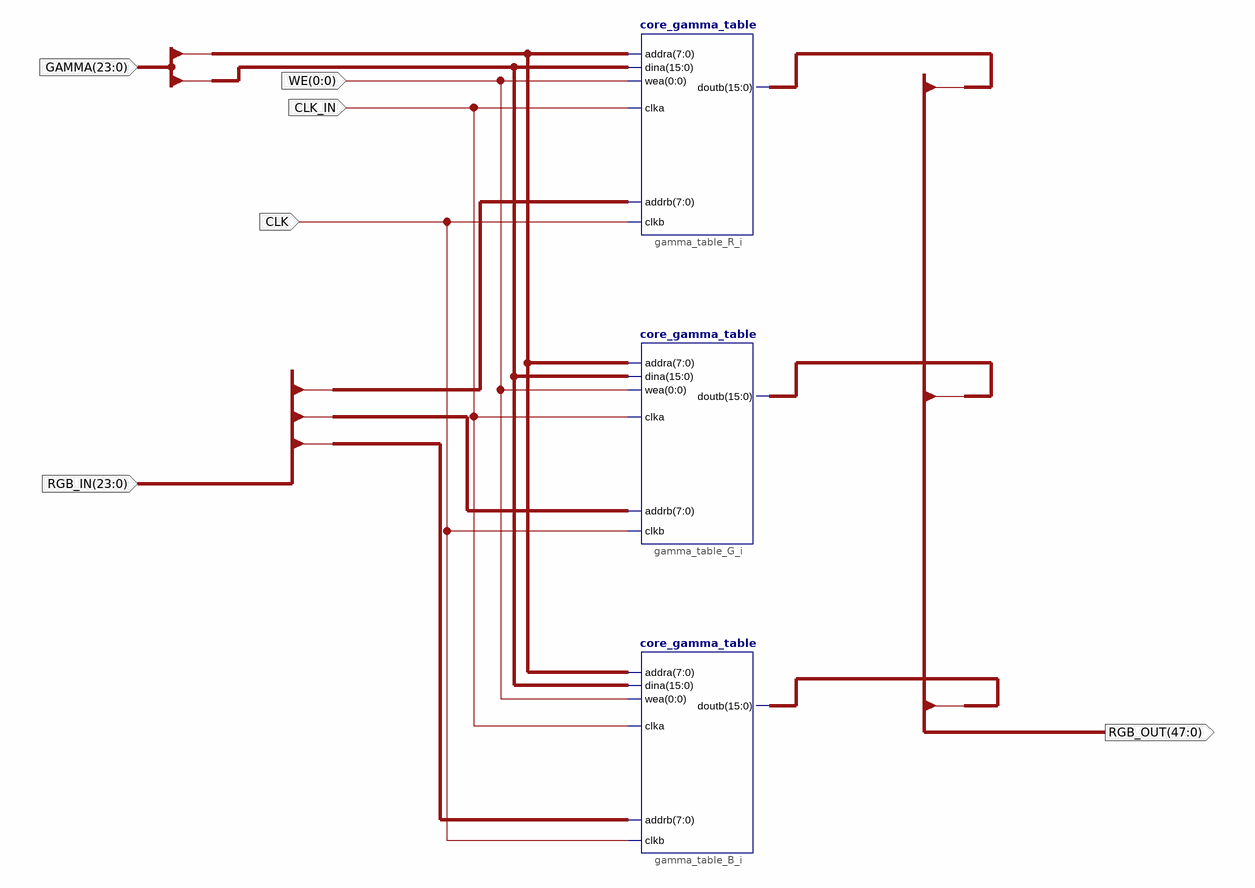
[diagram p0: schematic sheet 1]
// Xilinx ISE schematic RGB_GAMMA_SCH.sch (spartan6) as structural Verilog: 3 symbols, 6 ports
module RGB_GAMMA_SCH (
  input  [0:0] WE,
  input  CLK_IN,
  input  CLK,
  input  [23:0] GAMMA,
  input  [23:0] RGB_IN,
  output [47:0] RGB_OUT
);

  core_gamma_table gamma_table_R_i (
    .addra(GAMMA[23:16]), .dina(GAMMA[15:0]), .addrb(RGB_IN[23:16]), .wea(WE[0]), .clka(CLK_IN), .clkb(CLK),
    .doutb(RGB_OUT[47:32]));
  core_gamma_table gamma_table_G_i (
    .addra(GAMMA[23:16]), .dina(GAMMA[15:0]), .addrb(RGB_IN[15:8]), .wea(WE[0]), .clka(CLK_IN), .clkb(CLK),
    .doutb(RGB_OUT[31:16]));
  core_gamma_table gamma_table_B_i (
    .addra(GAMMA[23:16]), .dina(GAMMA[15:0]), .addrb(RGB_IN[7:0]), .wea(WE[0]), .clka(CLK_IN), .clkb(CLK),
    .doutb(RGB_OUT[15:0]));
endmodule
